# Altium schematic sheet ETH_on_RS485_Node_Example_Mikrocontroller.SchDoc: Microcontroller
size A3; DrawnBy: Nico Korn; Engineer: Nico Korn; Organization: Reichle & De-Massari; Address1: Binzstrasse 32; Address2: 8620 Wetzikon; Address3: Switzerland; DocumentNumber: 2; Revision: V1.0; SheetNumber: 2; SheetTotal: 7; Description1: Beschreibung; Size: A3; ShortDescription: Mikrocontroller
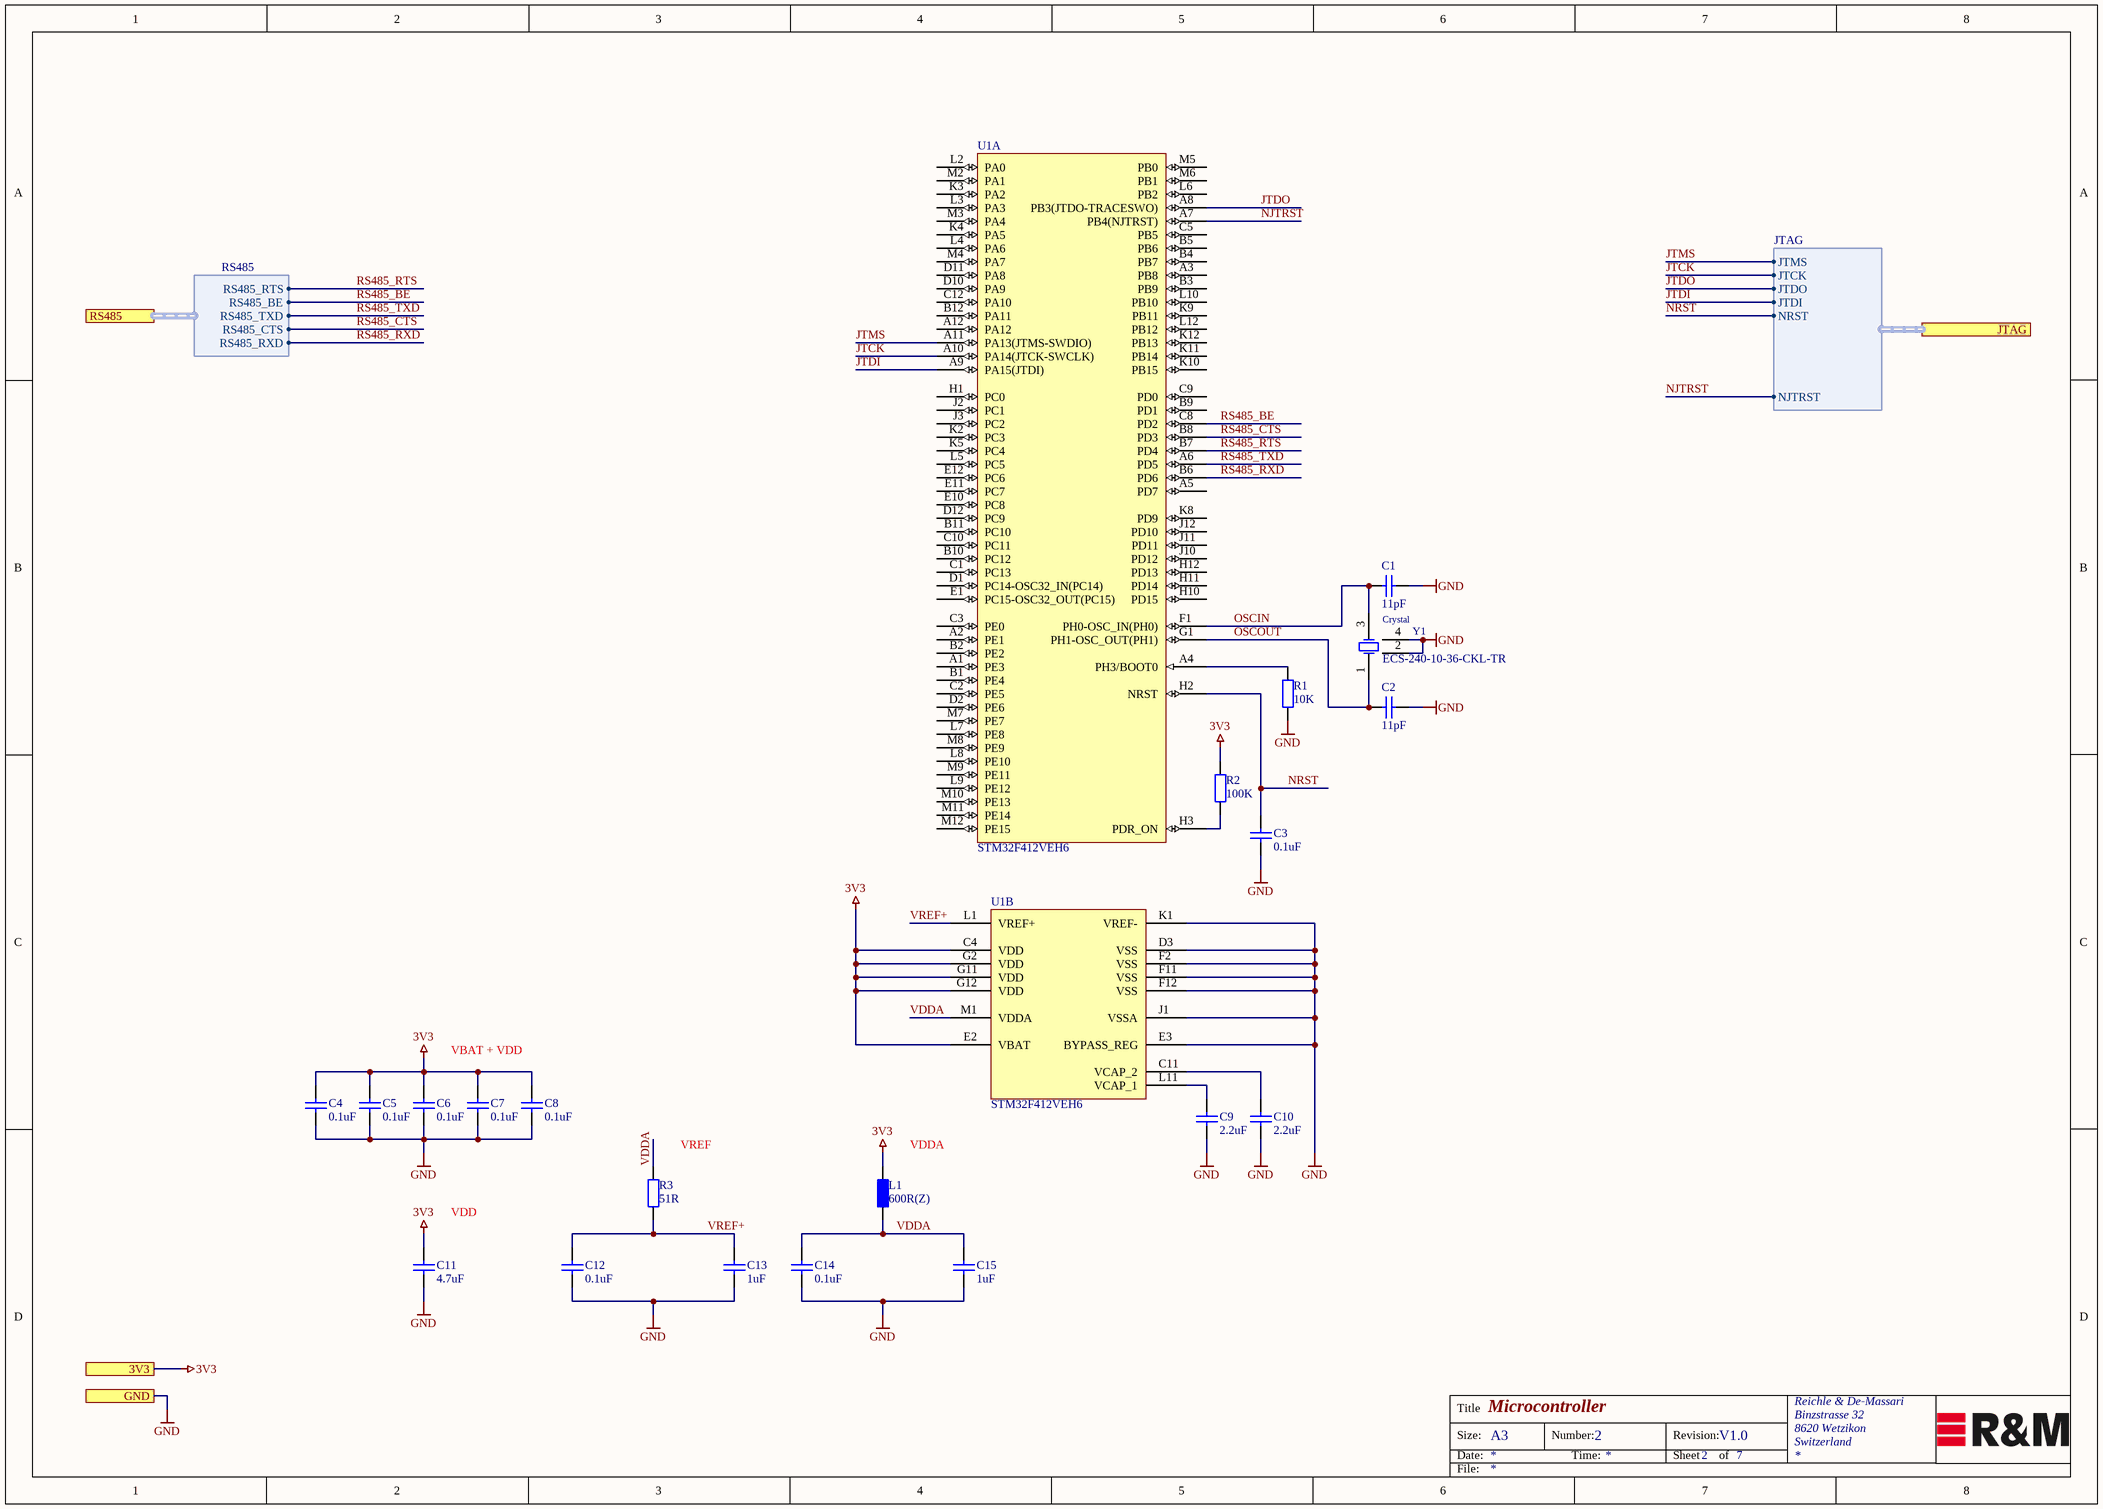
[diagram p0: ETH_on_RS485_Node_Example_Mikrocontroller.SchDoc]

## Parts
C1  11pF  [Ceramic Capacitor 0402 EIA]
C2  11pF  [Ceramic Capacitor 0402 EIA]
C3  0.1uF  [Ceramic Capacitor 0402 EIA]
C4  0.1uF  [Ceramic Capacitor 0402 EIA]
C5  0.1uF  [Ceramic Capacitor 0402 EIA]
C6  0.1uF  [Ceramic Capacitor 0402 EIA]
C7  0.1uF  [Ceramic Capacitor 0402 EIA]
C8  0.1uF  [Ceramic Capacitor 0402 EIA]
C9  2.2uF  [Ceramic Capacitor 0402 EIA]
C10  2.2uF  [Ceramic Capacitor 0402 EIA]
C11  4.7uF  [Ceramic Capacitor 0603 EIA]
C12  0.1uF  [Ceramic Capacitor 0402 EIA]
C13  1uF  [Ceramic Capacitor 0402 EIA]
C14  0.1uF  [Ceramic Capacitor 0402 EIA]
C15  1uF  [Ceramic Capacitor 0402 EIA]
L1  600R(Z)  [Inductor 0603 EIA]
R1  10K  [Resistor 0402 EIA]
R2  100K  [Resistor 0402 EIA]
R3  51R  [Resistor 0402 EIA]
U1  STM32F412VEH6  [STM_UFBGA100 7x7x0.6_100_R]  (parts A,B of 2)
Y1  Crystal  [ECS_ECX-2236_4_R]

## Ports
3V3, GND, JTAG (harness JTAG), RS485 (harness RS485)

## Harnesses
JTAG: JTMS, JTCK, JTDI, JTDO, NRST, NJTRST
RS485: RS485_RXD, RS485_CTS, RS485_TXD, RS485_BE, RS485_RTS

## Nets
3V3: C4.1 C5.1 C6.1 C7.1 C8.1 C11.2 L1.1 R2.2 U1.C4(VDD) U1.E2(VBAT) U1.G2(VDD) U1.G11(VDD) U1.G12(VDD) ; port 3V3
GND: C1.2 C2.2 C3.2 C4.2 C5.2 C6.2 C7.2 C8.2 C9.1 C10.1 C11.1 C12.1 C13.1 C14.1 C15.1 R1.1 U1.D3(VSS) U1.E3(BYPASS_REG) U1.F2(VSS) U1.F11(VSS) U1.F12(VSS) U1.J1(VSSA) U1.K1(VREF-) Y1.2(OSC2) Y1.4(OSC3) ; port GND
JTCK: U1.A10(PA14(JTCK-SWCLK)) ; port JTAG.JTCK
JTDI: U1.A9(PA15(JTDI)) ; port JTAG.JTDI
JTDO: U1.A8(PB3(JTDO-TRACESWO)) ; port JTAG.JTDO
JTMS: U1.A11(PA13(JTMS-SWDIO)) ; port JTAG.JTMS
NJTRST: U1.A7(PB4(NJTRST)) ; port JTAG.NJTRST
NRST: C3.1 U1.H2(NRST) ; port JTAG.NRST
OSCIN: C1.1 U1.F1(PH0-OSC_IN(PH0)) Y1.3(OSC2)
OSCOUT: C2.1 U1.G1(PH1-OSC_OUT(PH1)) Y1.1(OSC1)
RS485_BE: U1.C8(PD2) ; port RS485.RS485_BE
RS485_CTS: U1.B8(PD3) ; port RS485.RS485_CTS
RS485_RTS: U1.B7(PD4) ; port RS485.RS485_RTS
RS485_RXD: U1.B6(PD6) ; port RS485.RS485_RXD
RS485_TXD: U1.A6(PD5) ; port RS485.RS485_TXD
VDDA: C14.2 C15.2 L1.2 R3.2 U1.M1(VDDA)
VREF+: C12.2 C13.2 R3.1 U1.L1(VREF+)
NetC9_2: C9.2 U1.L11(VCAP_1)
NetC10_2: C10.2 U1.C11(VCAP_2)
NetR1_2: R1.2 U1.A4(PH3/BOOT0)
NetR2_1: R2.1 U1.H3(PDR_ON)

Not connected (* = marked no-connect by the designer): U1 A1(PE3) A2(PE1) A3(PB8) A5(PD7) A12(PA12) B1(PE4) B2(PE2) B3(PB9) B4(PB7) B5(PB6) B9(PD1) B10(PC12) B11(PC10) B12(PA11) C1(PC13) C2(PE5) C3(PE0) C5(PB5) C9(PD0) C10(PC11) C12(PA10) D1(PC14-OSC32_IN(PC14)) D2(PE6) D10(PA9) D11(PA8) D12(PC9) E1(PC15-OSC32_OUT(PC15)) E10(PC8) E11(PC7) E12(PC6) H1(PC0) H10(PD15) H11(PD14) H12(PD13) J2(PC1) J3(PC2) J10(PD12) J11(PD11) J12(PD10) K2(PC3) K3(PA2) K4(PA5) K5(PC4) K8(PD9) K9(PB11) K10(PB15) K11(PB14) K12(PB13) L2(PA0) L3(PA3) L4(PA6) L5(PC5) L6(PB2) L7(PE8) L8(PE10) L9(PE12) L10(PB10) L12(PB12) M2(PA1) M3(PA4) M4(PA7) M5(PB0) M6(PB1) M7(PE7) M8(PE9) M9(PE11) M10(PE13) M11(PE14) M12(PE15)

## Notes on the sheet
- VBAT + VDD
- (near R3) VREF
- (near L1) VDDA
- (near C11) VDD
- Title
- Size:
- Date:
- A3
- Number:
- Time:
- Revision:
- Sheet
- of
- File:

## Library data of the parts
C1 C2 = Cap_11pF_0402: SMD/SMT 0402 11pF 50volts C0G 5%; Manufacturer: Murata; Manufacturer PartNr: GRM1555C1H110JA01D; voltage: 50VDC; Dielectric Grade: C0G (NP0); Replaceable: yes; value: 11pF; tolerance: 5%; ComponentLink1Description: mouser; ComponentLink1URL: https://www.mouser.ch/ProductDetail/Murata-Electronics/GRM1555C1H110JA01D?qs=%2fha2pyFadug34NHqLs7eMMmZ4IY%2fB%2fBwtGmZmE%252bqlNJIuNiWKDU4cio3ILTIjZ7Z; Footprint/Package: 0402; Supplier 1: Mouser; Supplier 2: Digi-Key; Supplier 3: Farnell; Supplier Part Number 1: 81-GRM1555C1H110JA1D; Supplier Part Number 2: 490-5923-6-ND; Supplier Part Number 3: 2218837
C3-C8 C12 C14 = Cap_0.1uF_0402: SMD/SMT WCAP-CSGP 0.1uF 0402 20% 10V MLCC; Manufacturer: Wurth Electronics; Manufacturer PartNr: 885012105010; voltage: 10VDC; Dielectric Grade: X5R; Replaceable: yes; tolerance: 20%; value: 0.1uF; ComponentLink1Description: mouser; ComponentLink1URL: https://www.mouser.ch/ProductDetail/Wurth-Electronics/885012105010?qs=sGAEpiMZZMs0AnBnWHyRQEGbLOF2VP1ihL84oCjXnlO407YOHi%2fQbw%3d%3d; Footprint/Package: 0402; Supplier 1: Mouser; Supplier 2: Farnell; Supplier 3: Digi-Key; Supplier Part Number 1: 710-885012105010; Supplier Part Number 2: 2533928; Supplier Part Number 3: 732-7487-1-ND
C9 C10 = Cap_2.2uF_0402: 2.2µF ±20% 25V Ceramic Capacitor X5R 0402 (1005 Metric); Manufacturer: Murata; Manufacturer PartNr: GRM155R61E225ME15D; Replaceable: yes; value: 2.2uF; tolerance: ±20%; voltage: 25V; Dielectric Grade: X5R; Footprint/Package: 0402; ComponentLink1Description: digikey; ComponentLink1URL: https://www.digikey.com/product-detail/en/murata-electronics-north-america/GRM155R61E225ME15D/490-10457-2-ND/5027542
C11 = Cap_4.7uF_0603: SMD/SMT 0603 4.7uF 10volts; Manufracturer: Murata; Manufacturer PartNr: GRM188R61A475KE15D; tolerance: 20%; voltage: 10VDC; Dielectric Grade: X5R; Replaceable: yes; value: 4.7uF; Footprint/Package: 0603
C13 C15 = Cap_1uF_0402: SMD/SMT 0402 1uF 10volts X7S 10%; Manufacturer: Murata; Manufacturer PartNr: GCM155C71A105KE38D; voltage: 10VDC; Replaceable: yes; value: 1uF; tolerance: 10%; ComponentLink1Description: mouser; ComponentLink1URL: https://www.mouser.ch/ProductDetail/Murata-Electronics/GCM155C71A105KE38D?qs=sGAEpiMZZMsh%252b1woXyUXj0FEAttKcN54ouz5zO04smg%3d; Dielectric Grade: X7S; Footprint/Package: 0402; Supplier 1: Mouser; Supplier 2: Digi-Key; Supplier Part Number 1: 81-GCM155C71A105KE8D; Supplier Part Number 2: 490-13409-6-ND
L1 = Ind_600R_0603: Ferritperlen MULTILYR CHP BD 0603 600OHMS 25%; Manufacturer: Taiyo Yuden; Manufacturer PartNr: BK1608HS601-T; Replaceable: yes; current: 350mA; value: 600R(Z); tolerance: 25%; power: *; Footprint/Package: 0603; ComponentLink1Description: mouser; ComponentLink1URL: https://www.mouser.ch/ProductDetail/Taiyo-Yuden/BK1608HS601-T?qs=sGAEpiMZZMtdyQheitOmRas3gyT7ksc5fkIjduyDg6k%3D
R1 = Res_10K_0402: SMD 10K ohm 1% 50V General Purpose; Manufacturer: Yageo; Manufacturer PartNr: RC0402FR-1010KL; power: 63mW; Replaceable: yes; value: 10K; tolerance: 1%; ComponentLink1Description: mouser; ComponentLink1URL: https://www.mouser.ch/ProductDetail/Yageo/RC0402FR-1010KL?qs=sGAEpiMZZMtlubZbdhIBIEgN9MQql2m6Sb2LnYlCICU%3d; Footprint/Package: 0402; Supplier 1: Mouser; Supplier Part Number 1: 603-RC0402FR-1010KL
R2 = Res_100K_0402: 100 kOhm Resistor 0402; Manufacturer: Vishay; Manufacturer PartNr: CRCW0402100KJNEDC; power: 63mW; Replaceable: yes; value: 100K; tolerance: -; Footprint/Package: 0402
R3 = Res_51R_0402: Resistor; Manufacturer: Yageo; Manufacturer PartNr: RC0402JR-0751RL; tolerance: 5%; power: 62.5mW; Replaceable: yes; value: 51R; Footprint/Package: 0402; ComponentLink1Description: mouser; ComponentLink1URL: https://www.mouser.ch/ProductDetail/Yageo/RC0402JR-0751RL?qs=sGAEpiMZZMtG0KNrPCHnjTtiZEI2zSDg2UFCMmEjZXQ%3d
U1 = STM_STM32F412VEH6_UFBGA100 7x7x0.6_100_1: STM32 Dynamic Efficiency MCU with BAM, High-performance and DSP with FPU, ARM Cortex-M4 MCU with 512 Kbytes Flash, 100 MHz CPU, Art Accelerator, DFSDM; Manufacturer: STM; Manufacturer PartNr: STM32F412VEH6; ShortDescription: STM32F412VEH6
Y1 = ECS-240-10-36-CKL-TR: Quarze 24MHz 10pF 10ppm -10C +70C; Manufacturer PartNr: ECS-240-10-36-CKL-TR